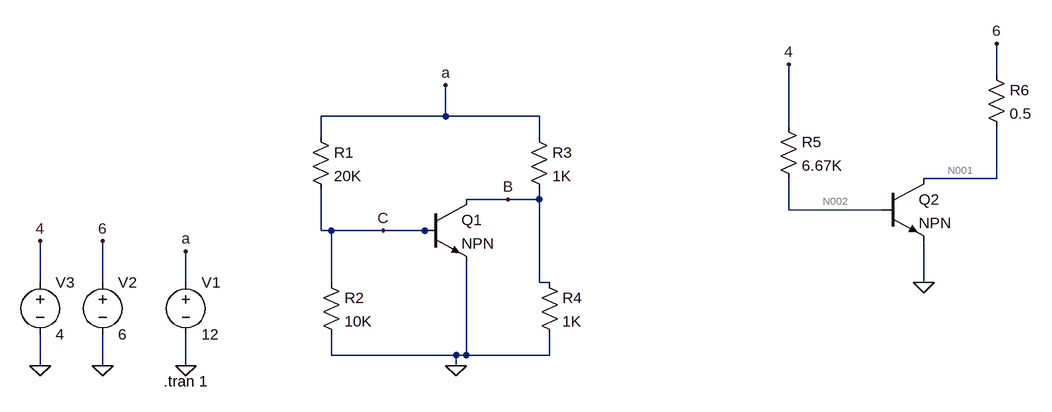
[diagram p0: schematic Draft35.asc]
Draft35.asc, the LTspice schematic file:
Version 4
SHEET 1 1276 680
WIRE 1216 -272 1216 -320
WIRE 368 -208 368 -256
WIRE 368 -208 176 -208
WIRE 512 -208 368 -208
WIRE 896 -192 896 -288
WIRE 176 -176 176 -208
WIRE 512 -176 512 -208
WIRE 1216 -112 1216 -192
WIRE 1216 -112 1104 -112
WIRE 464 -80 400 -80
WIRE 512 -80 512 -96
WIRE 512 -80 464 -80
WIRE 896 -64 896 -112
WIRE 1040 -64 896 -64
WIRE 176 -32 176 -96
WIRE 192 -32 176 -32
WIRE 272 -32 192 -32
WIRE 336 -32 272 -32
WIRE 352 -32 336 -32
WIRE -256 48 -256 -16
WIRE -160 48 -160 -16
WIRE -32 48 -32 0
WIRE 192 48 192 -32
WIRE 512 48 512 -80
WIRE 528 48 512 48
WIRE 1104 48 1104 -16
WIRE 192 160 192 128
WIRE 384 160 192 160
WIRE 400 160 400 16
WIRE 400 160 384 160
WIRE 528 160 528 128
WIRE 528 160 400 160
WIRE -256 176 -256 128
WIRE -160 176 -160 128
WIRE -32 176 -32 128
WIRE 384 176 384 160
FLAG 384 176 0
FLAG 368 -256 a
FLAG 272 -32 C
FLAG 464 -80 B
FLAG -32 0 a
FLAG -32 176 0
FLAG 1104 48 0
FLAG -256 -16 4
FLAG 896 -288 4
FLAG 1216 -320 6
FLAG -160 -16 6
FLAG -160 176 0
FLAG -256 176 0
SYMBOL voltage -32 32 R0
WINDOW 123 0 0 Left 0
WINDOW 39 0 0 Left 0
SYMATTR InstName V1
SYMATTR Value 12
SYMBOL res 160 -192 R0
SYMATTR InstName R1
SYMATTR Value 20K
SYMBOL res 176 32 R0
SYMATTR InstName R2
SYMATTR Value 10K
SYMBOL res 496 -192 R0
SYMATTR InstName R3
SYMATTR Value 1K
SYMBOL res 512 32 R0
SYMATTR InstName R4
SYMATTR Value 1K
SYMBOL npn 336 -80 R0
SYMATTR InstName Q1
SYMBOL res 880 -208 R0
SYMATTR InstName R5
SYMATTR Value 6.67K
SYMBOL res 1200 -288 R0
SYMATTR InstName R6
SYMATTR Value 0.5
SYMBOL npn 1040 -112 R0
SYMATTR InstName Q2
SYMBOL voltage -160 32 R0
WINDOW 123 0 0 Left 0
WINDOW 39 0 0 Left 0
SYMATTR InstName V2
SYMATTR Value 6
SYMBOL voltage -256 32 R0
WINDOW 123 0 0 Left 0
WINDOW 39 0 0 Left 0
SYMATTR InstName V3
SYMATTR Value 4
TEXT -66 200 Left 2 !.tran 1

The netlist it stands for:
* Draft35.asc
V1 a 0 12
R1 a C 20K
R2 C 0 10K
R3 a B 1K
R4 B 0 1K
Q1 B C 0 0 NPN
R5 4 N002 6.67K
R6 6 N001 0.5
Q2 N001 N002 0 0 NPN
V2 6 0 6
V3 4 0 4
.model NPN NPN
.model PNP PNP
.lib standard.bjt
.tran 1
.backanno
.end

* Results of the author's LTspice run, read from the files saved beside the schematic
* Operating Point, zero values left out:
*   V(a) = 12 V
*   V(c) = 839.6 mV
*   V(b) = 92.59 mV
*   V(4) = 4 V
*   V(n002) = 873.7 mV
*   V(6) = 6 V
*   V(n001) = 5.977 V
*   Ic(Q2) = 46.87 mA
*   Ib(Q2) = 468.7 µA
*   Ie(Q2) = -47.34 mA
*   Ic(Q1) = 11.81 mA
*   Ib(Q1) = 474.1 µA
*   Ie(Q1) = -12.29 mA
*   I(R6) = 46.87 mA
*   I(R5) = 468.7 µA
*   I(R4) = 92.59 µA
*   I(R3) = 11.91 mA
*   I(R2) = 83.96 µA
*   I(R1) = 558 µA
*   I(V3) = -468.7 µA
*   I(V2) = -46.87 mA
*   I(V1) = -12.47 mA